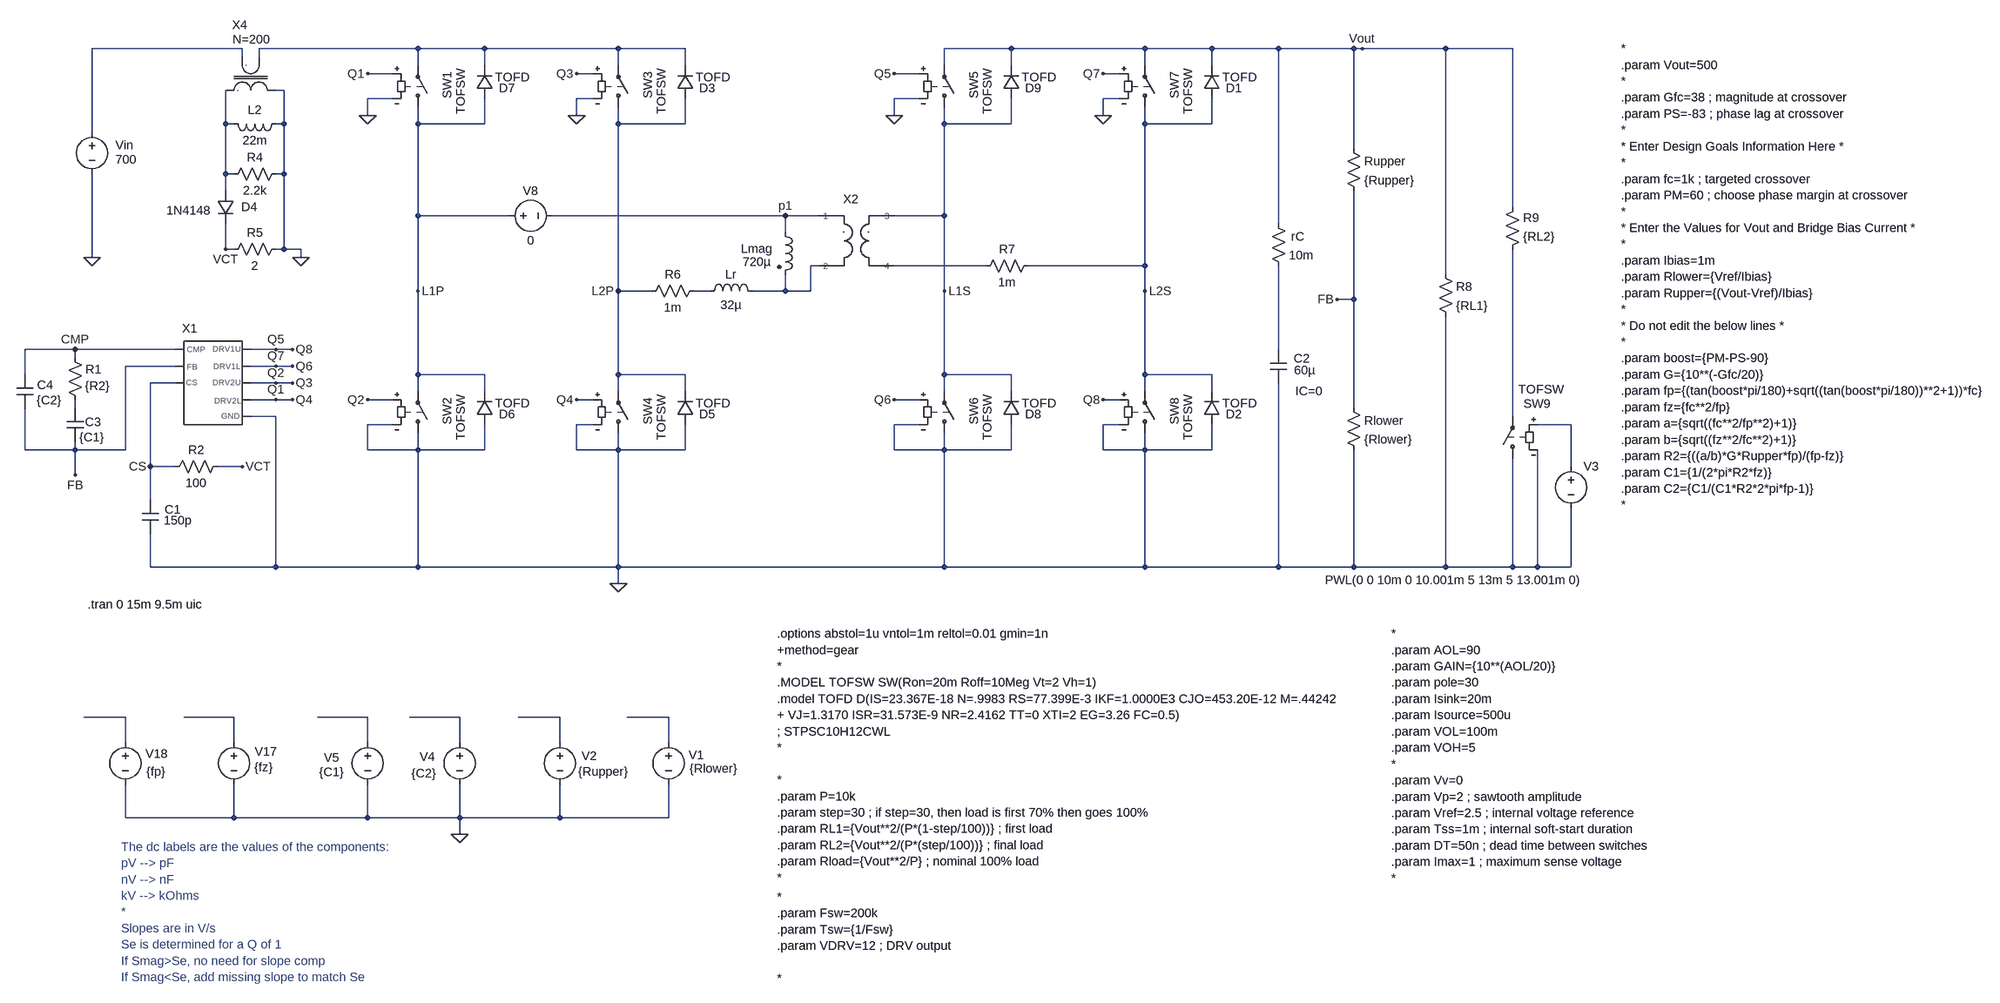
[diagram p0: schematic Dual Active Bridge VM - nonisolated - cbc - load step.asc]
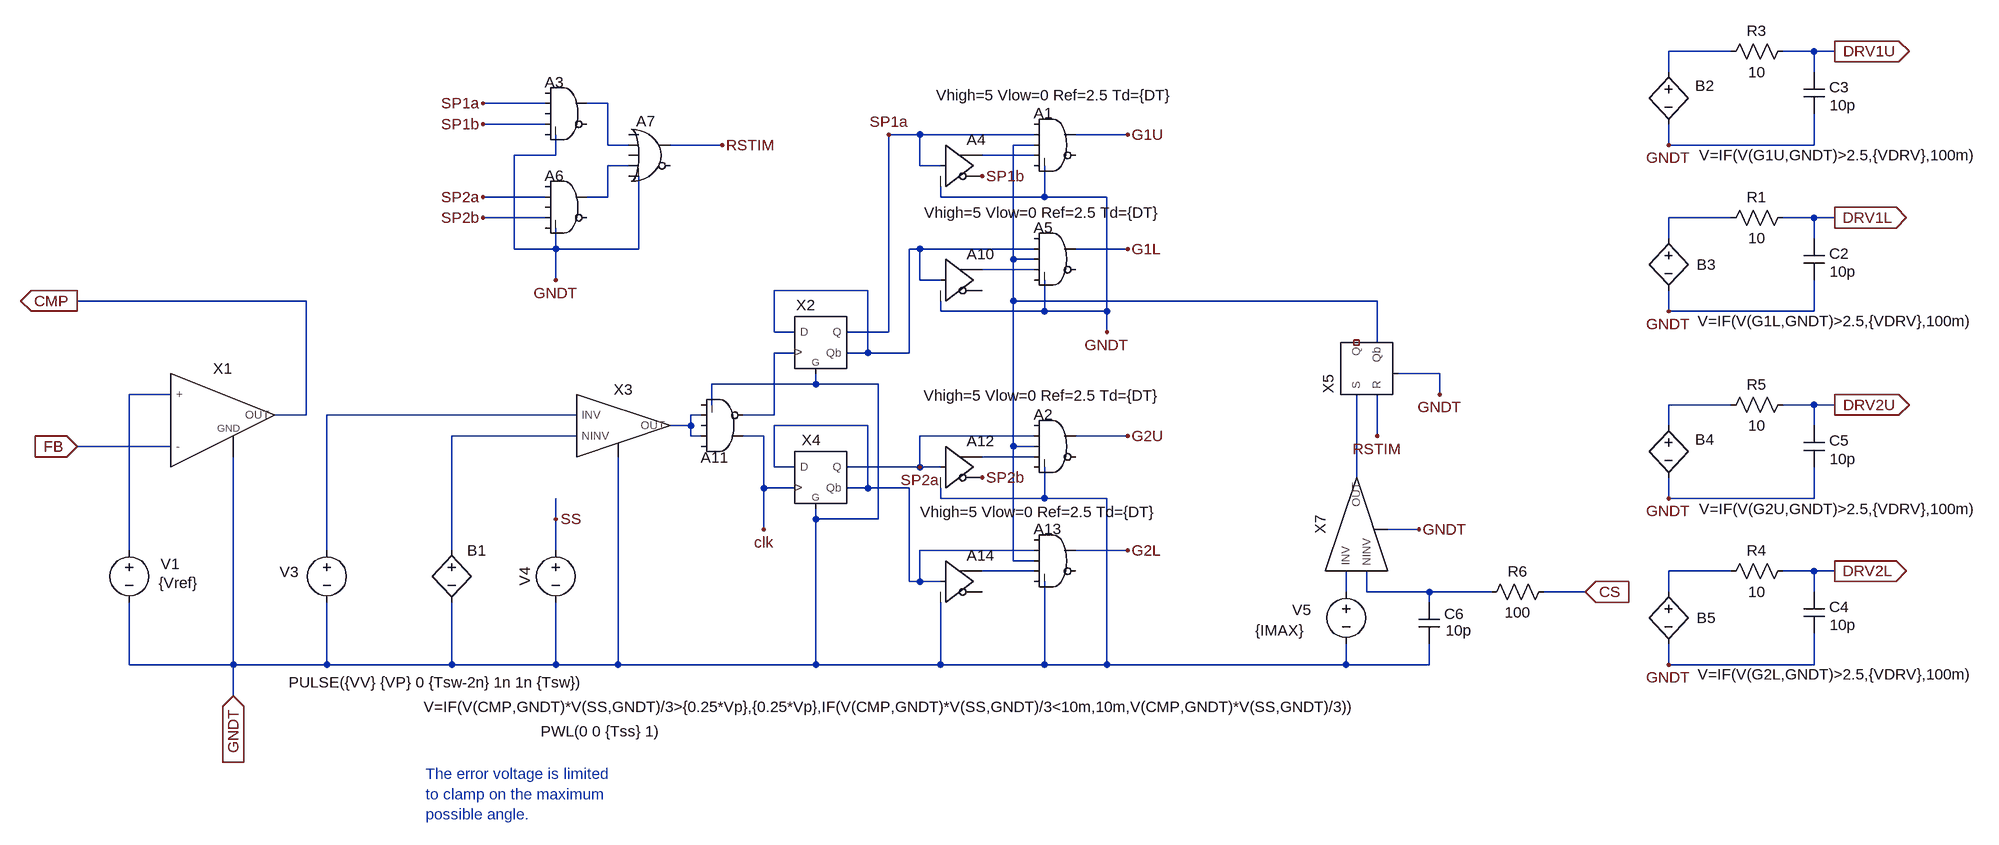
[diagram p1: sub-circuit generic_dab_vm_pwm.asc]
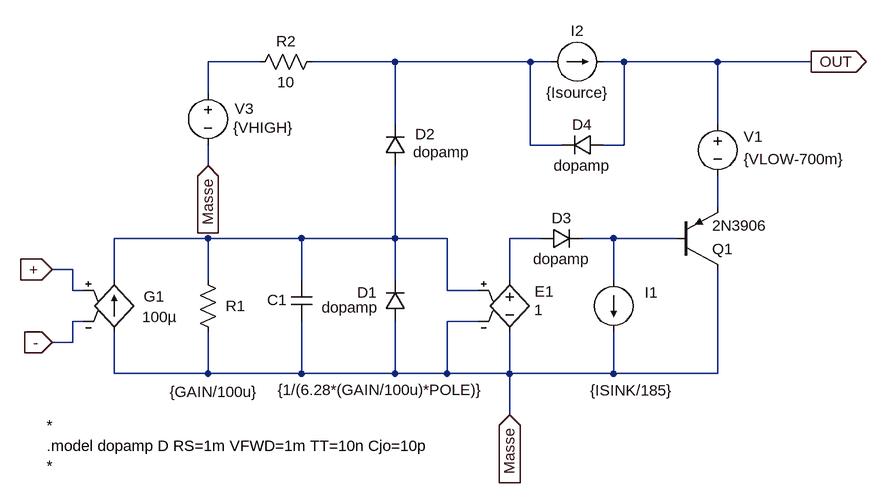
[diagram p2: sub-circuit op_amp_fan_out.asc]
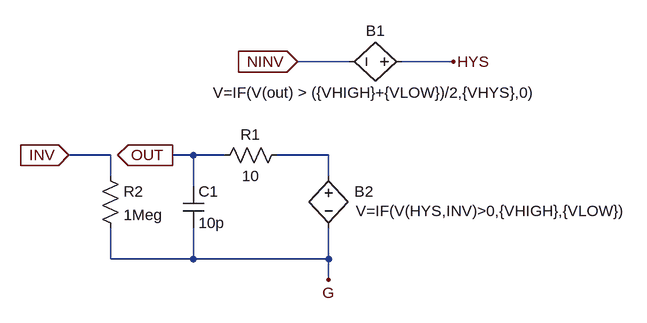
[diagram p3: sub-circuit comptof_g.asc]
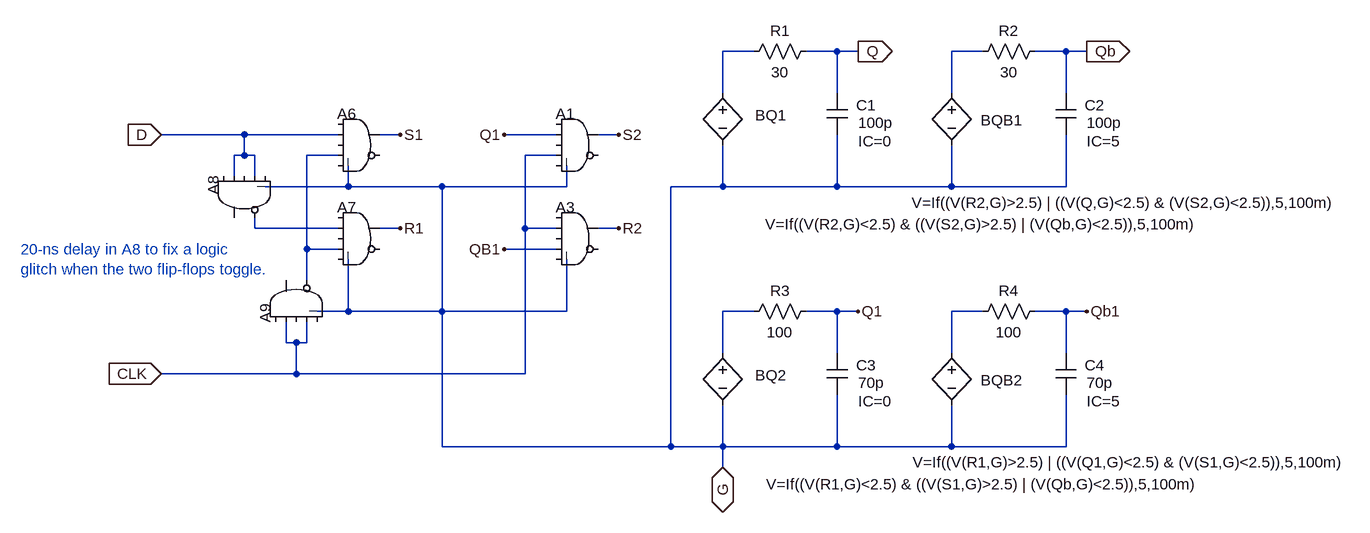
[diagram p4: sub-circuit d_flipflop_g.asc]
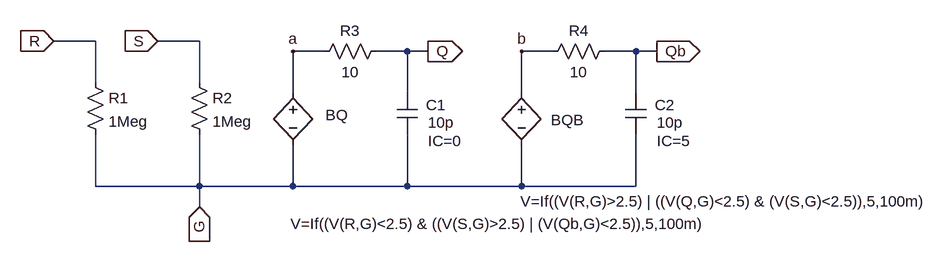
[diagram p5: sub-circuit sr_latch_g.asc]
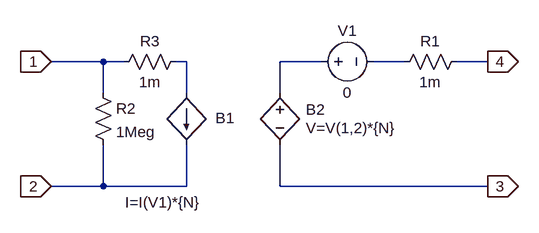
[diagram p6: sub-circuit ct_xfmr.asc]
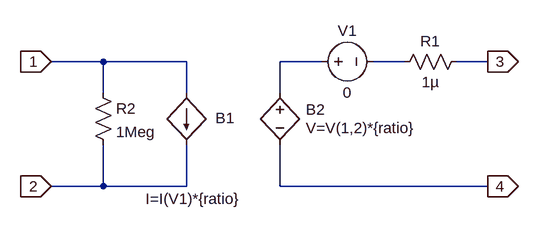
[diagram p7: sub-circuit xfmr.asc]
Dual Active Bridge VM - nonisolated - cbc - load step.asc, the LTspice schematic file:
Version 4.1
SHEET 1 4528 1992
WIRE 64 -384 -224 -384
WIRE 400 -384 96 -384
WIRE 528 -384 400 -384
WIRE 784 -384 528 -384
WIRE 912 -384 784 -384
WIRE 1536 -384 1408 -384
WIRE 1792 -384 1536 -384
WIRE 1920 -384 1792 -384
WIRE 2048 -384 1920 -384
WIRE 2192 -384 2048 -384
WIRE 2208 -384 2192 -384
WIRE 2368 -384 2208 -384
WIRE 2496 -384 2368 -384
WIRE 64 -368 64 -384
WIRE 96 -368 96 -384
WIRE 400 -352 400 -384
WIRE 528 -352 528 -384
WIRE 784 -352 784 -384
WIRE 912 -352 912 -384
WIRE 1408 -352 1408 -384
WIRE 1536 -352 1536 -384
WIRE 1792 -352 1792 -384
WIRE 1920 -352 1920 -384
WIRE 352 -336 304 -336
WIRE 736 -336 704 -336
WIRE 1360 -336 1312 -336
WIRE 1744 -336 1712 -336
WIRE 144 -304 128 -304
WIRE 352 -288 304 -288
WIRE 736 -288 704 -288
WIRE 1360 -288 1312 -288
WIRE 1744 -288 1712 -288
WIRE 304 -256 304 -288
WIRE 704 -256 704 -288
WIRE 1312 -256 1312 -288
WIRE 1712 -256 1712 -288
WIRE 32 -240 32 -304
WIRE 48 -240 32 -240
WIRE 144 -240 144 -304
WIRE 144 -240 128 -240
WIRE 400 -240 400 -272
WIRE 528 -240 528 -288
WIRE 528 -240 400 -240
WIRE 784 -240 784 -272
WIRE 912 -240 912 -288
WIRE 912 -240 784 -240
WIRE 1408 -240 1408 -272
WIRE 1536 -240 1536 -288
WIRE 1536 -240 1408 -240
WIRE 1792 -240 1792 -272
WIRE 1920 -240 1920 -288
WIRE 1920 -240 1792 -240
WIRE -224 -224 -224 -384
WIRE 2192 -192 2192 -384
WIRE 32 -144 32 -240
WIRE 48 -144 32 -144
WIRE 144 -144 144 -240
WIRE 144 -144 128 -144
WIRE 32 -112 32 -144
WIRE 2496 -80 2496 -384
WIRE 400 -64 400 -240
WIRE 576 -64 400 -64
WIRE 1104 -64 656 -64
WIRE 1168 -64 1104 -64
WIRE 1408 -64 1408 -240
WIRE 1408 -64 1312 -64
WIRE 2048 -48 2048 -384
WIRE 1104 -32 1104 -64
WIRE 32 0 32 -48
WIRE 48 0 32 0
WIRE 144 0 144 -144
WIRE 144 0 128 0
WIRE 176 0 144 0
WIRE -224 16 -224 -144
WIRE 176 16 176 0
WIRE 1168 32 1152 32
WIRE 1488 32 1312 32
WIRE 1792 32 1792 -240
WIRE 1792 32 1568 32
WIRE 2368 48 2368 -384
WIRE 400 80 400 -64
WIRE 784 80 784 -240
WIRE 848 80 784 80
WIRE 960 80 928 80
WIRE 1104 80 1104 48
WIRE 1104 80 1040 80
WIRE 1152 80 1152 32
WIRE 1152 80 1104 80
WIRE 1408 80 1408 -64
WIRE 1792 80 1792 32
WIRE 2192 96 2192 -112
WIRE 2192 96 2160 96
WIRE -256 192 -352 192
WIRE -64 192 -256 192
WIRE 128 192 80 192
WIRE 160 192 128 192
WIRE 2048 192 2048 32
WIRE -256 208 -256 192
WIRE -64 224 -160 224
WIRE 128 224 80 224
WIRE 160 224 128 224
WIRE -352 240 -352 192
WIRE 400 240 400 80
WIRE 528 240 400 240
WIRE 784 240 784 80
WIRE 912 240 784 240
WIRE 1408 240 1408 80
WIRE 1536 240 1408 240
WIRE 1792 240 1792 80
WIRE 1920 240 1792 240
WIRE -64 256 -112 256
WIRE 128 256 80 256
WIRE 160 256 128 256
WIRE 400 272 400 240
WIRE 528 272 528 240
WIRE 784 272 784 240
WIRE 912 272 912 240
WIRE 1408 272 1408 240
WIRE 1536 272 1536 240
WIRE 1792 272 1792 240
WIRE 1920 272 1920 240
WIRE 128 288 80 288
WIRE 160 288 128 288
WIRE 352 288 304 288
WIRE 736 288 704 288
WIRE 1360 288 1312 288
WIRE 1744 288 1712 288
WIRE -256 304 -256 288
WIRE 2192 304 2192 96
WIRE 128 320 80 320
WIRE 2496 320 2496 0
WIRE 352 336 304 336
WIRE 736 336 704 336
WIRE 1360 336 1312 336
WIRE 1744 336 1712 336
WIRE 2608 336 2544 336
WIRE -352 384 -352 304
WIRE -256 384 -256 368
WIRE -256 384 -352 384
WIRE -160 384 -160 224
WIRE -160 384 -256 384
WIRE 304 384 304 336
WIRE 400 384 400 352
WIRE 400 384 304 384
WIRE 528 384 528 336
WIRE 528 384 400 384
WIRE 704 384 704 336
WIRE 784 384 784 352
WIRE 784 384 704 384
WIRE 912 384 912 336
WIRE 912 384 784 384
WIRE 1312 384 1312 336
WIRE 1408 384 1408 352
WIRE 1408 384 1312 384
WIRE 1536 384 1536 336
WIRE 1536 384 1408 384
WIRE 1712 384 1712 336
WIRE 1792 384 1792 352
WIRE 1792 384 1712 384
WIRE 1920 384 1920 336
WIRE 1920 384 1792 384
WIRE -112 416 -112 256
WIRE -64 416 -112 416
WIRE 64 416 16 416
WIRE 2608 416 2608 336
WIRE -256 432 -256 384
WIRE -112 480 -112 416
WIRE -112 608 -112 544
WIRE 128 608 128 320
WIRE 128 608 -112 608
WIRE 400 608 400 384
WIRE 400 608 128 608
WIRE 784 608 784 384
WIRE 784 608 400 608
WIRE 1408 608 1408 384
WIRE 1408 608 784 608
WIRE 1792 608 1792 384
WIRE 1792 608 1408 608
WIRE 2048 608 2048 256
WIRE 2048 608 1792 608
WIRE 2192 608 2192 384
WIRE 2192 608 2048 608
WIRE 2368 608 2368 128
WIRE 2368 608 2192 608
WIRE 2496 608 2496 400
WIRE 2496 608 2368 608
WIRE 2544 608 2544 384
WIRE 2544 608 2496 608
WIRE 2608 608 2608 496
WIRE 2608 608 2544 608
WIRE 784 640 784 608
WIRE -160 896 -240 896
WIRE 48 896 -48 896
WIRE 304 896 208 896
WIRE 480 896 384 896
WIRE 672 896 592 896
WIRE 880 896 800 896
WIRE -160 944 -160 896
WIRE 48 944 48 896
WIRE 304 944 304 896
WIRE 480 944 480 896
WIRE 672 944 672 896
WIRE 880 944 880 896
WIRE -160 1088 -160 1024
WIRE 48 1088 48 1024
WIRE 48 1088 -160 1088
WIRE 304 1088 304 1024
WIRE 304 1088 48 1088
WIRE 480 1088 480 1024
WIRE 480 1088 304 1088
WIRE 672 1088 672 1024
WIRE 672 1088 480 1088
WIRE 880 1088 880 1024
WIRE 880 1088 672 1088
WIRE 480 1120 480 1088
FLAG -224 16 0
FLAG 2208 -384 Vout
FLAG 784 640 0
FLAG 480 1120 0
FLAG 304 -256 0
FLAG 704 -256 0
FLAG 304 -336 Q1
FLAG 704 288 Q4
FLAG 304 288 Q2
FLAG 704 -336 Q3
FLAG 1104 -64 p1
FLAG 2160 96 FB
FLAG -256 432 FB
FLAG -256 192 CMP
FLAG 400 80 L1P
FLAG 784 80 L2P
FLAG -112 416 CS
FLAG 32 0 VCT
FLAG 176 16 0
FLAG 1312 -256 0
FLAG 1712 -256 0
FLAG 1312 -336 Q5
FLAG 1712 288 Q8
FLAG 1312 288 Q6
FLAG 1712 -336 Q7
FLAG 1408 80 L1S
FLAG 1792 80 L2S
FLAG 160 192 Q8
FLAG 128 192 Q5
FLAG 160 224 Q6
FLAG 128 224 Q7
FLAG 160 256 Q3
FLAG 128 256 Q2
FLAG 160 288 Q4
FLAG 128 288 Q1
FLAG 64 416 VCT
DATAFLAG 224 896 ""
DATAFLAG 416 896 ""
DATAFLAG 608 896 ""
DATAFLAG 832 896 ""
DATAFLAG -32 896 ""
DATAFLAG -192 896 ""
SYMBOL ind2 1088 -48 R0
WINDOW 0 -69 47 Left 2
WINDOW 3 -66 72 Left 2
SYMATTR InstName Lmag
SYMATTR Value 720µ
SYMATTR Type ind
SYMBOL res 2032 -64 R0
WINDOW 0 40 40 Left 2
SYMATTR InstName rC
SYMATTR Value 10m
SYMBOL cap 2032 192 R0
WINDOW 0 45 17 Left 2
WINDOW 3 46 40 Left 2
WINDOW 123 48 80 Left 2
SYMATTR InstName C2
SYMATTR Value 60µ
SYMATTR Value2 IC=0
SYMBOL voltage -224 -240 R0
WINDOW 0 45 41 Left 2
WINDOW 3 45 68 Left 2
SYMATTR InstName Vin
SYMATTR Value 700
SYMBOL cap -128 480 R0
WINDOW 0 43 18 Left 2
WINDOW 3 42 39 Left 2
SYMATTR InstName C1
SYMATTR Value 150p
SYMBOL voltage 880 928 R0
WINDOW 0 39 40 Left 2
WINDOW 3 40 66 Left 2
WINDOW 123 0 0 Left 0
WINDOW 39 0 0 Left 0
SYMATTR InstName V1
SYMATTR Value {Rlower}
SYMBOL voltage 672 928 R0
WINDOW 0 42 42 Left 2
WINDOW 3 35 72 Left 2
WINDOW 123 0 0 Left 0
WINDOW 39 0 0 Left 0
SYMATTR InstName V2
SYMATTR Value {Rupper}
SYMBOL voltage 480 928 R0
WINDOW 0 -76 44 Left 2
WINDOW 3 -92 75 Left 2
SYMATTR InstName V4
SYMATTR Value {C2}
SYMBOL voltage 304 928 R0
WINDOW 0 -84 45 Left 2
WINDOW 3 -93 73 Left 2
WINDOW 123 0 0 Left 0
WINDOW 39 0 0 Left 0
SYMATTR InstName V5
SYMATTR Value {C1}
SYMBOL voltage 48 928 R0
WINDOW 0 40 34 Left 2
WINDOW 3 39 64 Left 2
WINDOW 123 0 0 Left 0
WINDOW 39 0 0 Left 0
SYMATTR InstName V17
SYMATTR Value {fz}
SYMBOL voltage -160 928 R0
WINDOW 0 39 38 Left 2
WINDOW 3 40 72 Left 2
SYMATTR InstName V18
SYMATTR Value {fp}
SYMBOL res 2176 288 R0
SYMATTR InstName Rlower
SYMATTR Value {Rlower}
SYMBOL res 2176 -208 R0
SYMATTR InstName Rupper
SYMATTR Value {Rupper}
SYMBOL sw 784 -256 M180
WINDOW 3 83 89 VLeft 2
WINDOW 0 57 84 VLeft 2
SYMATTR Value TOFSW
SYMATTR InstName SW3
SYMBOL diode 896 -288 M180
WINDOW 0 43 20 Left 2
WINDOW 3 36 41 Left 2
SYMATTR InstName D3
SYMATTR Value TOFD
SYMBOL sw 784 368 M180
WINDOW 3 83 89 VLeft 2
WINDOW 0 57 84 VLeft 2
SYMATTR Value TOFSW
SYMATTR InstName SW4
SYMBOL diode 896 336 M180
WINDOW 0 43 20 Left 2
WINDOW 3 36 41 Left 2
SYMATTR InstName D5
SYMATTR Value TOFD
SYMBOL sw 400 368 M180
WINDOW 3 83 89 VLeft 2
WINDOW 0 57 84 VLeft 2
SYMATTR Value TOFSW
SYMATTR InstName SW2
SYMBOL diode 512 336 M180
WINDOW 0 43 20 Left 2
WINDOW 3 36 41 Left 2
SYMATTR InstName D6
SYMATTR Value TOFD
SYMBOL sw 400 -256 M180
WINDOW 3 83 89 VLeft 2
WINDOW 0 57 84 VLeft 2
SYMATTR Value TOFSW
SYMATTR InstName SW1
SYMBOL diode 512 -288 M180
WINDOW 0 43 20 Left 2
WINDOW 3 36 41 Left 2
SYMATTR InstName D7
SYMATTR Value TOFD
SYMBOL voltage 560 -64 M90
WINDOW 0 -32 56 VBottom 2
WINDOW 3 32 56 VTop 2
SYMATTR InstName V8
SYMATTR Value 0
SYMBOL ind 944 96 R270
WINDOW 0 32 56 VTop 2
WINDOW 3 5 56 VBottom 2
SYMATTR InstName Lr
SYMATTR Value 32µ
SYMBOL cap -272 304 R0
WINDOW 0 35 27 Left 2
SYMATTR InstName C3
SYMATTR Value {C1}
SYMBOL res -272 192 R0
WINDOW 0 36 38 Left 2
WINDOW 3 35 70 Left 2
SYMATTR InstName R1
SYMATTR Value {R2}
SYMBOL cap -368 240 R0
WINDOW 0 39 20 Left 2
WINDOW 3 38 49 Left 2
SYMATTR InstName C4
SYMATTR Value {C2}
SYMBOL res 32 400 R90
WINDOW 0 0 56 VBottom 2
WINDOW 3 32 56 VTop 2
SYMATTR InstName R2
SYMATTR Value 100
SYMBOL ind 144 -256 R90
WINDOW 0 5 56 VBottom 2
WINDOW 3 32 56 VTop 2
SYMATTR InstName L2
SYMATTR Value 22m
SYMBOL res 144 -160 R90
WINDOW 0 0 56 VBottom 2
WINDOW 3 32 56 VTop 2
SYMATTR InstName R4
SYMATTR Value 2.2k
SYMBOL diode 16 -112 R0
WINDOW 0 46 31 Left 2
WINDOW 3 -97 38 Left 2
SYMATTR InstName D4
SYMATTR Value 1N4148
SYMBOL res 144 -16 R90
WINDOW 0 0 56 VBottom 2
WINDOW 3 32 56 VTop 2
SYMATTR InstName R5
SYMATTR Value 2
SYMBOL res 944 64 R90
WINDOW 0 0 56 VBottom 2
WINDOW 3 32 56 VTop 2
SYMATTR InstName R6
SYMATTR Value 1m
SYMBOL sw 1792 -256 M180
WINDOW 3 83 89 VLeft 2
WINDOW 0 57 84 VLeft 2
SYMATTR Value TOFSW
SYMATTR InstName SW7
SYMBOL diode 1904 -288 M180
WINDOW 0 43 20 Left 2
WINDOW 3 36 41 Left 2
SYMATTR InstName D1
SYMATTR Value TOFD
SYMBOL sw 1792 368 M180
WINDOW 3 83 89 VLeft 2
WINDOW 0 57 84 VLeft 2
SYMATTR Value TOFSW
SYMATTR InstName SW8
SYMBOL diode 1904 336 M180
WINDOW 0 43 20 Left 2
WINDOW 3 36 41 Left 2
SYMATTR InstName D2
SYMATTR Value TOFD
SYMBOL sw 1408 368 M180
WINDOW 3 83 89 VLeft 2
WINDOW 0 57 84 VLeft 2
SYMATTR Value TOFSW
SYMATTR InstName SW6
SYMBOL diode 1520 336 M180
WINDOW 0 43 20 Left 2
WINDOW 3 36 41 Left 2
SYMATTR InstName D8
SYMATTR Value TOFD
SYMBOL sw 1408 -256 M180
WINDOW 3 83 89 VLeft 2
WINDOW 0 57 84 VLeft 2
SYMATTR Value TOFSW
SYMATTR InstName SW5
SYMBOL diode 1520 -288 M180
WINDOW 0 43 20 Left 2
WINDOW 3 36 41 Left 2
SYMATTR InstName D9
SYMATTR Value TOFD
SYMBOL res 1584 16 R90
WINDOW 0 0 56 VBottom 2
WINDOW 3 32 56 VTop 2
SYMATTR InstName R7
SYMATTR Value 1m
SYMBOL res 2352 32 R0
SYMATTR InstName R8
SYMATTR Value {RL1}
SYMBOL res 2480 16 M180
WINDOW 0 36 76 Left 2
WINDOW 3 36 40 Left 2
SYMATTR InstName R9
SYMATTR Value {RL2}
SYMBOL sw 2496 416 R180
WINDOW 3 -98 148 Left 2
WINDOW 0 -73 120 Left 2
SYMATTR Value TOFSW
SYMATTR InstName SW9
SYMBOL voltage 2608 400 R0
WINDOW 3 -471 233 Left 2
WINDOW 123 0 0 Left 0
WINDOW 39 0 0 Left 0
SYMATTR Value PWL(0 0 10m 0 10.001m 5 13m 5 13.001m 0)
SYMATTR InstName V3
SYMBOL TOF\\Subcircuits\\Generic_DAB_VM_PWM 0 192 R0
WINDOW 0 -37 -25 Bottom 2
SYMATTR InstName X1
SYMATTR SpiceLine gain={gain} pole={pole} Isink={Isink} Isource={Isource} Vlow={VOL} Vhigh={VOH} DT={DT}
SYMBOL TOF\\Subcircuits\\CT_xfmr 64 -320 M90
WINDOW 0 -125 -5 VTop 2
WINDOW 39 -97 17 VTop 2
SYMATTR InstName X4
SYMATTR SpiceLine N=200
SYMBOL TOF\\Subcircuits\\XFMR 1200 -48 R0
WINDOW 0 29 -32 Bottom 2
SYMATTR InstName X2
SYMATTR SpiceLine Ratio=650m
TEXT -232 680 Left 2 !.tran 0 15m 9.5m uic
TEXT 1088 1240 Left 2 !*\n.param Fsw=200k\n.param Tsw={1/Fsw}\n.param VDRV=12 ; DRV output\n \n*
TEXT 2264 736 Left 2 !* \n.param AOL=90\n.param GAIN={10**(AOL/20)}\n.param pole=30\n.param Isink=20m\n.param Isource=500u\n.param VOL=100m\n.param VOH=5\n*\n.param Vv=0\n.param Vp=2 ; sawtooth amplitude\n.param Vref=2.5 ; internal voltage reference\n.param Tss=1m ; internal soft-start duration\n.param DT=50n ; dead time between switches\n.param Imax=1 ; maximum sense voltage\n*
TEXT -168 1144 Left 2 ;The dc labels are the values of the components:\npV --> pF\nnV --> nF\nkV --> kOhms\n*\nSlopes are in V/s\nSe is determined for a Q of 1\nIf Smag>Se, no need for slope comp\nIf Smag<Se, add missing slope to match Se
TEXT 2704 -384 Left 2 !*\n.param Vout=500\n*\n.param Gfc=38 ; magnitude at crossover\n.param PS=-83 ; phase lag at crossover\n*\n* Enter Design Goals Information Here *\n*\n.param fc=1k ; targeted crossover\n.param PM=60 ; choose phase margin at crossover\n*\n* Enter the Values for Vout and Bridge Bias Current *\n*\n.param Ibias=1m\n.param Rlower={Vref/Ibias}\n.param Rupper={(Vout-Vref)/Ibias}\n*\n* Do not edit the below lines *\n*\n.param boost={PM-PS-90}\n.param G={10**(-Gfc/20)}\n.param fp={(tan(boost*pi/180)+sqrt((tan(boost*pi/180))**2+1))*fc}\n.param fz={fc**2/fp}\n.param a={sqrt((fc**2/fp**2)+1)}\n.param b={sqrt((fz**2/fc**2)+1)}\n.param R2={((a/b)*G*Rupper*fp)/(fp-fz)}\n.param C1={1/(2*pi*R2*fz)}\n.param C2={C1/(C1*R2*2*pi*fp-1)}\n*
TEXT 1088 736 Left 2 !.options abstol=1u vntol=1m reltol=0.01 gmin=1n\n+method=gear\n*\n.MODEL TOFSW SW(Ron=20m Roff=10Meg Vt=2 Vh=1)\n.model TOFD D(IS=23.367E-18 N=.9983 RS=77.399E-3 IKF=1.0000E3 CJO=453.20E-12 M=.44242\n+ VJ=1.3170 ISR=31.573E-9 NR=2.4162 TT=0 XTI=2 EG=3.26 FC=0.5)\n; STPSC10H12CWL\n*
TEXT 1088 1016 Left 2 !*\n.param P=10k\n.param step=30 ; if step=30, then load is first 70% then goes 100%\n.param RL1={Vout**2/(P*(1-step/100))} ; first load\n.param RL2={Vout**2/(P*(step/100))} ; final load\n.param Rload={Vout**2/P} ; nominal 100% load\n*

generic_dab_vm_pwm.asc, the sub-circuit schematic file:
Version 4.1
SHEET 1 1568 1692
WIRE 1072 -832 976 -832
WIRE 1200 -832 1152 -832
WIRE 1232 -832 1200 -832
WIRE 976 -800 976 -832
WIRE 1200 -800 1200 -832
WIRE -752 -752 -848 -752
WIRE -656 -752 -688 -752
WIRE -752 -720 -848 -720
WIRE -176 -704 -224 -704
WIRE 0 -704 -176 -704
WIRE 144 -704 64 -704
WIRE -656 -688 -656 -752
WIRE -624 -688 -656 -688
WIRE -480 -688 -560 -688
WIRE 0 -688 -32 -688
WIRE 976 -688 976 -720
WIRE 1200 -688 1200 -736
WIRE 1200 -688 976 -688
WIRE -736 -672 -736 -704
WIRE -736 -672 -800 -672
WIRE 0 -672 -80 -672
WIRE -624 -656 -656 -656
WIRE -176 -656 -176 -704
WIRE -144 -656 -176 -656
WIRE -752 -608 -848 -608
WIRE -656 -608 -656 -656
WIRE -656 -608 -688 -608
WIRE -144 -608 -144 -624
WIRE 16 -608 16 -656
WIRE 16 -608 -144 -608
WIRE 112 -608 16 -608
WIRE -752 -576 -848 -576
WIRE 1072 -576 976 -576
WIRE 1200 -576 1152 -576
WIRE 1232 -576 1200 -576
WIRE 976 -544 976 -576
WIRE 1200 -544 1200 -576
WIRE -800 -528 -800 -672
WIRE -736 -528 -736 -560
WIRE -736 -528 -800 -528
WIRE -608 -528 -608 -640
WIRE -608 -528 -736 -528
WIRE -176 -528 -192 -528
WIRE 0 -528 -176 -528
WIRE 144 -528 64 -528
WIRE -32 -512 -32 -688
WIRE 0 -512 -32 -512
WIRE 0 -496 -80 -496
WIRE -736 -480 -736 -528
WIRE -176 -480 -176 -528
WIRE -144 -480 -176 -480
WIRE -256 -464 -400 -464
WIRE -1120 -448 -1472 -448
WIRE -32 -448 -32 -512
WIRE 528 -448 -32 -448
WIRE -144 -432 -144 -448
WIRE 16 -432 16 -480
WIRE 16 -432 -144 -432
WIRE 112 -432 112 -608
WIRE 112 -432 16 -432
WIRE 976 -432 976 -464
WIRE 1200 -432 1200 -480
WIRE 1200 -432 976 -432
WIRE -400 -400 -400 -464
WIRE -368 -400 -400 -400
WIRE -224 -400 -224 -704
WIRE -224 -400 -288 -400
WIRE 112 -400 112 -432
WIRE 528 -384 528 -448
WIRE -368 -368 -400 -368
WIRE -256 -368 -256 -464
WIRE -256 -368 -288 -368
WIRE -192 -368 -192 -528
WIRE -192 -368 -256 -368
WIRE 624 -336 560 -336
WIRE -336 -320 -336 -336
WIRE -336 -320 -496 -320
WIRE -240 -320 -336 -320
WIRE -1328 -304 -1392 -304
WIRE 624 -304 624 -336
WIRE -496 -288 -496 -320
WIRE 1072 -288 976 -288
WIRE 1200 -288 1152 -288
WIRE 1232 -288 1200 -288
WIRE -1120 -272 -1120 -448
WIRE -1120 -272 -1168 -272
WIRE -704 -272 -1088 -272
WIRE -512 -272 -528 -272
WIRE -400 -272 -400 -368
WIRE -400 -272 -448 -272
WIRE -528 -256 -528 -272
WIRE -528 -256 -560 -256
WIRE -256 -256 -400 -256
WIRE 976 -256 976 -288
WIRE 1200 -256 1200 -288
WIRE -704 -240 -896 -240
WIRE -528 -240 -528 -256
WIRE -512 -240 -528 -240
WIRE -416 -240 -448 -240
WIRE 0 -240 -176 -240
WIRE 144 -240 64 -240
WIRE 528 -240 528 -304
WIRE -1328 -224 -1472 -224
WIRE -32 -224 -32 -448
WIRE 0 -224 -32 -224
WIRE 0 -208 -80 -208
WIRE -400 -192 -400 -256
WIRE -368 -192 -400 -192
WIRE -176 -192 -176 -240
WIRE -176 -192 -288 -192
WIRE -144 -192 -176 -192
WIRE 496 -176 496 -304
WIRE -416 -160 -416 -240
WIRE -368 -160 -416 -160
WIRE -256 -160 -256 -256
WIRE -256 -160 -288 -160
WIRE -192 -160 -256 -160
WIRE -144 -144 -144 -160
WIRE 16 -144 16 -192
WIRE 16 -144 -144 -144
WIRE 112 -144 16 -144
WIRE 976 -144 976 -176
WIRE 1200 -144 1200 -192
WIRE 1200 -144 976 -144
WIRE -736 -112 -736 -144
WIRE -336 -112 -336 -128
WIRE -240 -112 -240 -320
WIRE -240 -112 -336 -112
WIRE -416 -96 -416 -160
WIRE 592 -96 544 -96
WIRE -1392 -64 -1392 -304
WIRE -1088 -64 -1088 -272
WIRE -896 -64 -896 -240
WIRE -736 -64 -736 -112
WIRE 0 -64 -176 -64
WIRE 144 -64 64 -64
WIRE -32 -48 -32 -224
WIRE 0 -48 -32 -48
WIRE 0 -32 -80 -32
WIRE 1072 -32 976 -32
WIRE 1200 -32 1152 -32
WIRE 1232 -32 1200 -32
WIRE -192 -16 -192 -160
WIRE -176 -16 -176 -64
WIRE -176 -16 -192 -16
WIRE -144 -16 -176 -16
WIRE 480 0 480 -32
WIRE 512 0 512 -32
WIRE 608 0 512 0
WIRE 704 0 608 0
WIRE 848 0 784 0
WIRE 976 0 976 -32
WIRE 1200 0 1200 -32
WIRE 608 16 608 0
WIRE -1392 112 -1392 16
WIRE -1232 112 -1232 -208
WIRE -1232 112 -1392 112
WIRE -1088 112 -1088 16
WIRE -1088 112 -1232 112
WIRE -896 112 -896 16
WIRE -896 112 -1088 112
WIRE -736 112 -736 16
WIRE -736 112 -896 112
WIRE -640 112 -640 -208
WIRE -640 112 -736 112
WIRE -336 112 -336 -112
WIRE -336 112 -640 112
WIRE -144 112 -144 16
WIRE -144 112 -336 112
WIRE 16 112 16 -16
WIRE 16 112 -144 112
WIRE 112 112 112 -144
WIRE 112 112 16 112
WIRE 480 112 480 80
WIRE 480 112 112 112
WIRE 608 112 608 80
WIRE 608 112 480 112
WIRE 976 112 976 80
WIRE 1200 112 1200 64
WIRE 1200 112 976 112
WIRE -1232 160 -1232 112
FLAG -1472 -448 CMP
IOPIN -1472 -448 Out
FLAG -1472 -224 FB
IOPIN -1472 -224 In
FLAG -1232 160 GNDT
IOPIN -1232 160 In
FLAG -736 -112 SS
FLAG 976 -432 GNDT
FLAG 976 -688 GNDT
FLAG 1232 -576 DRV1L
IOPIN 1232 -576 Out
FLAG 1232 -832 DRV1U
IOPIN 1232 -832 Out
FLAG 976 112 GNDT
FLAG 976 -144 GNDT
FLAG 1232 -32 DRV2L
IOPIN 1232 -32 Out
FLAG 1232 -288 DRV2U
IOPIN 1232 -288 Out
FLAG 144 -704 G1U
FLAG 144 -528 G1L
FLAG 144 -240 G2U
FLAG 144 -64 G2L
FLAG 112 -400 GNDT
FLAG -416 -96 clk
FLAG -224 -704 SP1a
FLAG -80 -640 SP1b
FLAG -176 -192 SP2a
FLAG -80 -176 SP2b
FLAG 848 0 CS
IOPIN 848 0 In
FLAG 592 -96 GNDT
FLAG 624 -304 GNDT
FLAG 528 -240 RSTIM
FLAG -848 -752 SP1a
FLAG -848 -720 SP1b
FLAG -848 -608 SP2a
FLAG -848 -576 SP2b
FLAG -480 -688 RSTIM
FLAG -736 -480 GNDT
SYMBOL op_amp_fan_out -1248 -272 R0
SYMATTR InstName X1
SYMATTR SpiceLine gain={gain} pole={pole} Isink={Isink} Isource={Isource} Vlow={VOL} Vhigh={VOH}
SYMBOL voltage -1392 -80 R0
WINDOW 0 48 37 Left 2
WINDOW 3 45 66 Left 2
SYMATTR InstName V1
SYMATTR Value {Vref}
SYMBOL voltage -1088 -80 R0
WINDOW 0 -73 49 Left 2
WINDOW 3 -59 219 Left 2
WINDOW 123 0 0 Left 0
WINDOW 39 0 0 Left 0
SYMATTR InstName V3
SYMATTR Value PULSE({VV} {VP} 0 {Tsw-2n} 1n 1n {Tsw})
SYMBOL bv -896 -80 R0
WINDOW 3 -43 257 Left 2
SYMATTR Value V=IF(V(CMP,GNDT)*V(SS,GNDT)/3>{0.25*Vp},{0.25*Vp},IF(V(CMP,GNDT)*V(SS,GNDT)/3<10m,10m,V(CMP,GNDT)*V(SS,GNDT)/3))
SYMATTR InstName B1
SYMBOL voltage -736 -80 R0
WINDOW 0 -32 56 VBottom 2
WINDOW 3 69 279 Top 2
WINDOW 123 0 0 Left 0
WINDOW 39 0 0 Left 0
SYMATTR InstName V4
SYMATTR Value PWL(0 0 {Tss} 1)
SYMBOL bv 976 -816 R0
WINDOW 0 41 37 Left 2
WINDOW 3 47 144 Left 2
SYMATTR InstName B2
SYMATTR Value V=IF(V(G1U,GNDT)>2.5,{VDRV},100m)
SYMBOL bv 976 -560 R0
WINDOW 0 43 56 Left 2
WINDOW 3 45 143 Left 2
SYMATTR InstName B3
SYMATTR Value V=IF(V(G1L,GNDT)>2.5,{VDRV},100m)
SYMBOL res 1168 -592 R90
WINDOW 0 0 56 VBottom 2
WINDOW 3 32 56 VTop 2
SYMATTR InstName R1
SYMATTR Value 10
SYMBOL cap 1184 -544 R0
WINDOW 0 39 23 Left 2
WINDOW 3 40 51 Left 2
SYMATTR InstName C2
SYMATTR Value 10p
SYMBOL res 1168 -848 R90
WINDOW 0 0 56 VBottom 2
WINDOW 3 32 56 VTop 2
SYMATTR InstName R3
SYMATTR Value 10
SYMBOL cap 1184 -800 R0
WINDOW 0 39 23 Left 2
WINDOW 3 40 51 Left 2
SYMATTR InstName C3
SYMATTR Value 10p
SYMBOL Digital\\and 32 -752 R0
WINDOW 0 -33 15 Left 2
SYMATTR InstName A1
SYMATTR SpiceLine Vhigh=5 Vlow=0 Ref=2.5
SYMBOL Digital\\buf -144 -720 R0
WINDOW 39 -7 -45 Left 2
SYMATTR SpiceLine Vhigh=5 Vlow=0 Ref=2.5 Td={DT}
SYMATTR InstName A4
SYMBOL Digital\\and 32 -576 R0
WINDOW 0 -33 15 Left 2
SYMATTR InstName A5
SYMATTR SpiceLine Vhigh=5 Vlow=0 Ref=2.5
SYMBOL Digital\\buf -144 -544 R0
WINDOW 39 -25 -40 Left 2
SYMATTR SpiceLine Vhigh=5 Vlow=0 Ref=2.5 Td={DT}
SYMATTR InstName A10
SYMBOL Digital\\and -480 -192 M180
WINDOW 0 -33 15 Left 2
SYMATTR InstName A11
SYMATTR SpiceLine Vhigh=5 Vlow=0 Ref=2.5
SYMBOL Digital\\and 32 -288 R0
WINDOW 0 -33 15 Left 2
SYMATTR InstName A2
SYMATTR SpiceLine Vhigh=5 Vlow=0 Ref=2.5
SYMBOL Digital\\buf -144 -256 R0
WINDOW 39 -26 -46 Left 2
SYMATTR SpiceLine Vhigh=5 Vlow=0 Ref=2.5 Td={DT}
SYMATTR InstName A12
SYMBOL Digital\\and 32 -112 R0
WINDOW 0 -33 15 Left 2
SYMATTR InstName A13
SYMATTR SpiceLine Vhigh=5 Vlow=0 Ref=2.5
SYMBOL Digital\\buf -144 -80 R0
WINDOW 39 -31 -43 Left 2
SYMATTR SpiceLine Vhigh=5 Vlow=0 Ref=2.5 Td={DT}
SYMATTR InstName A14
SYMBOL bv 976 -272 R0
WINDOW 0 41 37 Left 2
WINDOW 3 47 144 Left 2
SYMATTR InstName B4
SYMATTR Value V=IF(V(G2U,GNDT)>2.5,{VDRV},100m)
SYMBOL bv 976 -16 R0
WINDOW 0 43 56 Left 2
WINDOW 3 45 143 Left 2
SYMATTR InstName B5
SYMATTR Value V=IF(V(G2L,GNDT)>2.5,{VDRV},100m)
SYMBOL res 1168 -48 R90
WINDOW 0 0 56 VBottom 2
WINDOW 3 32 56 VTop 2
SYMATTR InstName R4
SYMATTR Value 10
SYMBOL cap 1184 0 R0
WINDOW 0 39 23 Left 2
WINDOW 3 40 51 Left 2
SYMATTR InstName C4
SYMATTR Value 10p
SYMBOL res 1168 -304 R90
WINDOW 0 0 56 VBottom 2
WINDOW 3 32 56 VTop 2
SYMATTR InstName R5
SYMATTR Value 10
SYMBOL cap 1184 -256 R0
WINDOW 0 39 23 Left 2
WINDOW 3 40 51 Left 2
SYMATTR InstName C5
SYMATTR Value 10p
SYMBOL voltage 480 -16 R0
WINDOW 0 -83 44 Left 2
WINDOW 3 -140 75 Left 2
SYMATTR InstName V5
SYMATTR Value {IMAX}
SYMBOL res 800 -16 R90
WINDOW 0 0 56 VBottom 2
WINDOW 3 32 56 VTop 2
SYMATTR InstName R6
SYMATTR Value 100
SYMBOL cap 592 16 R0
WINDOW 0 39 18 Left 2
WINDOW 3 41 43 Left 2
SYMATTR InstName C6
SYMATTR Value 10p
SYMBOL Digital\\and -720 -800 R0
WINDOW 0 -33 15 Left 2
SYMATTR InstName A3
SYMATTR SpiceLine Vhigh=5 Vlow=0 Ref=2.5
SYMBOL Digital\\and -720 -656 R0
WINDOW 0 -33 15 Left 2
SYMATTR InstName A6
SYMATTR SpiceLine Vhigh=5 Vlow=0 Ref=2.5
SYMBOL Digital\\or -592 -736 R0
WINDOW 0 -20 11 Left 2
SYMATTR InstName A7
SYMATTR SpiceLine Vhigh=5 Vlow=0 Ref=2.5
SYMBOL TOF\\Subcircuits\\COMPTOF_G -640 -256 R0
SYMATTR InstName X3
SYMATTR SpiceLine VHIGH=5 VLOW=100m VHYS=10m
SYMBOL TOF\\Subcircuits\\D_FlipFlop_G -336 -384 R0
WINDOW 0 -15 -42 Bottom 2
SYMATTR InstName X2
SYMBOL TOF\\Subcircuits\\D_FlipFlop_G -336 -176 R0
WINDOW 0 -7 -42 Bottom 2
SYMATTR InstName X4
SYMBOL TOF\\Subcircuits\\SR_latch_G 512 -336 R270
WINDOW 0 -16 -44 Bottom 2
SYMATTR InstName X5
SYMBOL TOF\\Subcircuits\\COMPTOF_G 496 -96 R270
SYMATTR InstName X7
SYMATTR SpiceLine VHIGH=5 VLOW=100m VHYS=50m
TEXT -936 280 Left 2 ;The error voltage is limited\nto clamp on the maximum \npossible angle.

op_amp_fan_out.asc, the sub-circuit schematic file:
Version 4.1
SHEET 1 1504 680
WIRE 96 -224 16 -224
WIRE 304 -224 176 -224
WIRE 512 -224 304 -224
WIRE 544 -224 512 -224
WIRE 656 -224 624 -224
WIRE 800 -224 656 -224
WIRE 944 -224 800 -224
WIRE 16 -176 16 -224
WIRE 304 -128 304 -224
WIRE 800 -128 800 -224
WIRE 512 -96 512 -224
WIRE 560 -96 512 -96
WIRE 656 -96 656 -224
WIRE 656 -96 624 -96
WIRE 16 -64 16 -96
WIRE 800 0 800 -48
WIRE 16 48 -128 48
WIRE 160 48 16 48
WIRE 304 48 304 -64
WIRE 304 48 160 48
WIRE 384 48 304 48
WIRE 528 48 480 48
WIRE 640 48 592 48
WIRE 736 48 640 48
WIRE -192 96 -224 96
WIRE -128 112 -128 48
WIRE 16 112 16 48
WIRE 160 112 160 48
WIRE 304 112 304 48
WIRE 480 112 480 48
WIRE 640 112 640 48
WIRE -192 128 -192 96
WIRE -176 128 -192 128
WIRE 384 128 384 48
WIRE 432 128 384 128
WIRE -176 176 -192 176
WIRE 432 176 384 176
WIRE -192 208 -192 176
WIRE -192 208 -224 208
WIRE -128 256 -128 192
WIRE 16 256 16 192
WIRE 16 256 -128 256
WIRE 160 256 160 176
WIRE 160 256 16 256
WIRE 304 256 304 176
WIRE 304 256 160 256
WIRE 384 256 384 176
WIRE 384 256 304 256
WIRE 480 256 480 192
WIRE 480 256 384 256
WIRE 640 256 640 192
WIRE 640 256 480 256
WIRE 800 256 800 96
WIRE 800 256 640 256
WIRE 480 320 480 256
FLAG -224 96 +
IOPIN -224 96 In
FLAG -224 208 -
IOPIN -224 208 In
FLAG 944 -224 OUT
IOPIN 944 -224 Out
FLAG 480 320 Masse
IOPIN 480 320 In
FLAG 16 -64 Masse
IOPIN 16 -64 In
DATAFLAG 800 -16 ""
SYMBOL g -128 96 R0
WINDOW 0 45 41 Left 2
WINDOW 3 43 73 Left 2
SYMATTR InstName G1
SYMATTR Value 100µ
SYMBOL res 0 96 R0
WINDOW 0 43 56 Left 2
WINDOW 3 -43 188 Left 2
SYMATTR InstName R1
SYMATTR Value {GAIN/100u}
SYMBOL cap 144 112 R0
WINDOW 0 -37 31 Left 2
WINDOW 3 -21 169 Left 2
SYMATTR InstName C1
SYMATTR Value {1/(6.28*(GAIN/100u)*POLE)}
SYMBOL diode 320 176 R180
WINDOW 0 44 45 Left 2
WINDOW 3 41 22 Left 2
SYMATTR InstName D1
SYMATTR Value dopamp
SYMBOL e 480 96 R0
WINDOW 0 39 34 Left 2
WINDOW 3 38 62 Left 2
SYMATTR InstName E1
SYMATTR Value 1
SYMBOL diode 528 64 R270
WINDOW 0 32 32 VTop 2
WINDOW 3 0 32 VBottom 2
SYMATTR InstName D3
SYMATTR Value dopamp
SYMBOL current 640 112 R0
WINDOW 0 48 19 Left 2
WINDOW 3 -36 170 Left 2
SYMATTR InstName I1
SYMATTR Value {ISINK/185}
SYMBOL pnp 736 96 M180
SYMATTR InstName Q1
SYMATTR Value 2N3906
SYMBOL voltage 800 -144 R0
WINDOW 0 40 35 Left 2
WINDOW 3 40 70 Left 2
SYMATTR InstName V1
SYMATTR Value {VLOW-700m}
SYMBOL current 544 -224 R270
WINDOW 0 32 40 VTop 2
WINDOW 3 -32 40 VBottom 2
SYMATTR InstName I2
SYMATTR Value {Isource}
SYMBOL diode 624 -80 M270
WINDOW 0 32 32 VTop 2
WINDOW 3 0 32 VBottom 2
SYMATTR InstName D4
SYMATTR Value dopamp
SYMBOL voltage 16 -192 R0
WINDOW 0 41 40 Left 2
WINDOW 3 39 69 Left 2
SYMATTR InstName V3
SYMATTR Value {VHIGH}
SYMBOL diode 288 -64 M180
WINDOW 0 47 49 Left 2
WINDOW 3 44 21 Left 2
SYMATTR InstName D2
SYMATTR Value dopamp
SYMBOL res 192 -240 R90
WINDOW 0 0 56 VBottom 2
WINDOW 3 32 56 VTop 2
SYMATTR InstName R2
SYMATTR Value 10
TEXT -232 336 Left 2 !*\n.model dopamp D RS=1m VFWD=1m TT=10n Cjo=10p\n*

comptof_g.asc, the sub-circuit schematic file:
Version 4.1
SHEET 1 880 680
WIRE 64 192 -16 192
WIRE 224 192 144 192
WIRE -304 336 -368 336
WIRE -176 336 -208 336
WIRE -128 336 -176 336
WIRE 32 336 -48 336
WIRE -304 368 -304 336
WIRE 32 368 32 336
WIRE -176 384 -176 336
WIRE -304 496 -304 448
WIRE -176 496 -176 448
WIRE -176 496 -304 496
WIRE 32 496 32 448
WIRE 32 496 -176 496
WIRE 32 528 32 496
FLAG -16 192 NINV
IOPIN -16 192 In
FLAG 224 192 HYS
FLAG -208 336 OUT
IOPIN -208 336 Out
FLAG -368 336 INV
IOPIN -368 336 In
FLAG 32 528 G
SYMBOL bv 160 192 R90
WINDOW 0 -32 56 VBottom 2
WINDOW 3 32 56 VTop 2
SYMATTR InstName B1
SYMATTR Value V=IF(V(out) > ({VHIGH}+{VLOW})/2,{VHYS},0)
SYMBOL bv 32 352 R0
WINDOW 0 40 40 Left 2
WINDOW 3 42 70 Left 2
SYMATTR InstName B2
SYMATTR Value V=IF(V(HYS,INV)>0,{VHIGH},{VLOW})
SYMBOL res -32 320 R90
WINDOW 0 0 56 VBottom 2
WINDOW 3 32 56 VTop 2
SYMATTR InstName R1
SYMATTR Value 10
SYMBOL cap -192 384 R0
SYMATTR InstName C1
SYMATTR Value 10p
SYMBOL res -320 352 R0
SYMATTR InstName R2
SYMATTR Value 1Meg

d_flipflop_g.asc, the sub-circuit schematic file:
Version 4.1
SHEET 1 1820 1368
WIRE 768 448 720 448
WIRE 896 448 848 448
WIRE 928 448 896 448
WIRE 1120 448 1072 448
WIRE 1248 448 1200 448
WIRE 1280 448 1248 448
WIRE 720 512 720 448
WIRE 896 512 896 448
WIRE 1072 512 1072 448
WIRE 1248 512 1248 448
WIRE -16 576 -144 576
WIRE 128 576 -16 576
WIRE 224 576 192 576
WIRE 464 576 384 576
WIRE 560 576 528 576
WIRE -16 608 -16 576
WIRE -16 608 -32 608
WIRE 0 608 -16 608
WIRE 128 608 80 608
WIRE 464 608 416 608
WIRE -32 640 -32 608
WIRE 0 640 0 608
WIRE 144 656 144 624
WIRE 144 656 16 656
WIRE 288 656 144 656
WIRE 480 656 480 624
WIRE 480 656 288 656
WIRE 720 656 720 592
WIRE 720 656 640 656
WIRE 896 656 896 576
WIRE 896 656 720 656
WIRE 1072 656 1072 592
WIRE 1072 656 896 656
WIRE 1248 656 1248 576
WIRE 1248 656 1072 656
WIRE 0 720 0 704
WIRE 128 720 0 720
WIRE 224 720 192 720
WIRE 416 720 416 608
WIRE 464 720 416 720
WIRE 560 720 528 720
WIRE 80 752 80 608
WIRE 128 752 80 752
WIRE 464 752 384 752
WIRE 80 800 80 752
WIRE 144 848 144 768
WIRE 144 848 96 848
WIRE 288 848 288 656
WIRE 288 848 144 848
WIRE 480 848 480 768
WIRE 480 848 288 848
WIRE 768 848 720 848
WIRE 896 848 848 848
WIRE 928 848 896 848
WIRE 1120 848 1072 848
WIRE 1248 848 1200 848
WIRE 1280 848 1248 848
WIRE 48 896 48 864
WIRE 64 896 48 896
WIRE 80 896 80 864
WIRE 80 896 64 896
WIRE 720 912 720 848
WIRE 896 912 896 848
WIRE 1072 912 1072 848
WIRE 1248 912 1248 848
WIRE 64 944 64 896
WIRE 64 944 -144 944
WIRE 416 944 416 720
WIRE 416 944 64 944
WIRE 288 1056 288 848
WIRE 640 1056 640 656
WIRE 640 1056 288 1056
WIRE 720 1056 720 992
WIRE 720 1056 640 1056
WIRE 896 1056 896 976
WIRE 896 1056 720 1056
WIRE 1072 1056 1072 992
WIRE 1072 1056 896 1056
WIRE 1248 1056 1248 976
WIRE 1248 1056 1072 1056
WIRE 720 1088 720 1056
FLAG -144 576 D
IOPIN -144 576 In
FLAG -144 944 CLK
IOPIN -144 944 In
FLAG 560 576 S2
FLAG 560 720 R2
FLAG 928 448 Q
IOPIN 928 448 Out
FLAG 1280 448 Qb
IOPIN 1280 448 Out
FLAG 224 576 S1
FLAG 224 720 R1
FLAG 384 576 Q1
FLAG 384 752 QB1
FLAG 928 848 Q1
FLAG 1280 848 Qb1
FLAG 720 1088 G
IOPIN 720 1088 BiDir
SYMBOL Digital\\and 496 528 R0
WINDOW 0 -33 16 Left 2
SYMATTR InstName A1
SYMATTR SpiceLine Vhigh=5 Vlow=100m Ref=2.5
SYMBOL Digital\\and 496 672 R0
WINDOW 0 -33 16 Left 2
SYMATTR InstName A3
SYMATTR SpiceLine Vhigh=5 Vlow=100m Ref=2.5
SYMBOL Digital\\and 160 528 R0
WINDOW 0 -33 16 Left 2
SYMATTR InstName A6
SYMATTR SpiceLine Vhigh=5 Vlow=100m Ref=2.5
SYMBOL Digital\\and 160 672 R0
WINDOW 0 -33 16 Left 2
SYMATTR InstName A7
SYMATTR SpiceLine Vhigh=5 Vlow=100m Ref=2.5
SYMBOL Digital\\and -80 672 M90
WINDOW 0 -33 16 Left 2
SYMATTR InstName A8
SYMATTR SpiceLine Vhigh=5 Vlow=100m Ref=2.5 Td=20n
SYMBOL Digital\\and 0 832 R270
WINDOW 0 -33 16 Left 2
SYMATTR InstName A9
SYMATTR SpiceLine Vhigh=5 Vlow=100m Ref=2.5
SYMBOL bv 720 496 R0
WINDOW 0 50 50 Left 2
WINDOW 3 65 218 Left 2
SYMATTR InstName BQ1
SYMATTR Value V=If((V(R2,G)<2.5) & ((V(S2,G)>2.5) | (V(Qb,G)<2.5)),5,100m)
SYMBOL res 864 432 R90
WINDOW 0 0 56 VBottom 2
WINDOW 3 32 56 VTop 2
SYMATTR InstName R1
SYMATTR Value 30
SYMBOL cap 880 512 R0
WINDOW 0 45 19 Left 2
WINDOW 3 48 46 Left 2
WINDOW 123 48 74 Left 2
SYMATTR InstName C1
SYMATTR Value 100p
SYMATTR Value2 IC=0
SYMBOL bv 1072 496 R0
WINDOW 0 45 58 Left 2
WINDOW 3 -61 185 Left 2
SYMATTR InstName BQB1
SYMATTR Value V=If((V(R2,G)>2.5) | ((V(Q,G)<2.5) & (V(S2,G)<2.5)),5,100m)
SYMBOL res 1216 432 R90
WINDOW 0 0 56 VBottom 2
WINDOW 3 32 56 VTop 2
SYMATTR InstName R2
SYMATTR Value 30
SYMBOL cap 1232 512 R0
WINDOW 0 45 19 Left 2
WINDOW 3 48 46 Left 2
WINDOW 123 48 74 Left 2
SYMATTR InstName C2
SYMATTR Value 100p
SYMATTR Value2 IC=5
SYMBOL bv 720 896 R0
WINDOW 0 50 50 Left 2
WINDOW 3 67 218 Left 2
SYMATTR InstName BQ2
SYMATTR Value V=If((V(R1,G)<2.5) & ((V(S1,G)>2.5) | (V(Qb,G)<2.5)),5,100m)
SYMBOL res 864 832 R90
WINDOW 0 0 56 VBottom 2
WINDOW 3 32 56 VTop 2
SYMATTR InstName R3
SYMATTR Value 100
SYMBOL cap 880 912 R0
WINDOW 0 45 19 Left 2
WINDOW 3 48 46 Left 2
WINDOW 123 48 74 Left 2
SYMATTR InstName C3
SYMATTR Value 70p
SYMATTR Value2 IC=0
SYMBOL bv 1072 896 R0
WINDOW 0 45 58 Left 2
WINDOW 3 -60 184 Left 2
SYMATTR InstName BQB2
SYMATTR Value V=If((V(R1,G)>2.5) | ((V(Q1,G)<2.5) & (V(S1,G)<2.5)),5,100m)
SYMBOL res 1216 832 R90
WINDOW 0 0 56 VBottom 2
WINDOW 3 32 56 VTop 2
SYMATTR InstName R4
SYMATTR Value 100
SYMBOL cap 1232 912 R0
WINDOW 0 45 19 Left 2
WINDOW 3 48 46 Left 2
WINDOW 123 48 74 Left 2
SYMATTR InstName C4
SYMATTR Value 70p
SYMATTR Value2 IC=5
TEXT -360 752 Left 2 ;20-ns delay in A8 to fix a logic \nglitch when the two flip-flops toggle.

sr_latch_g.asc, the sub-circuit schematic file:
Version 4.1
SHEET 1 1168 680
WIRE -192 48 -256 48
WIRE -32 48 -96 48
WIRE 160 64 112 64
WIRE 288 64 240 64
WIRE 320 64 288 64
WIRE 512 64 464 64
WIRE 640 64 592 64
WIRE 672 64 640 64
WIRE -192 112 -192 48
WIRE -32 112 -32 48
WIRE 112 128 112 64
WIRE 288 128 288 64
WIRE 464 128 464 64
WIRE 640 128 640 64
WIRE -192 272 -192 192
WIRE -32 272 -32 192
WIRE -32 272 -192 272
WIRE 112 272 112 208
WIRE 112 272 -32 272
WIRE 288 272 288 192
WIRE 288 272 112 272
WIRE 464 272 464 208
WIRE 464 272 288 272
WIRE 640 272 640 192
WIRE 640 272 464 272
WIRE -32 304 -32 272
FLAG -256 48 R
IOPIN -256 48 In
FLAG -96 48 S
IOPIN -96 48 In
FLAG 320 64 Q
IOPIN 320 64 Out
FLAG 672 64 Qb
IOPIN 672 64 Out
FLAG 112 64 a
FLAG 464 64 b
FLAG -32 304 G
IOPIN -32 304 In
SYMBOL bv 112 112 R0
WINDOW 0 50 50 Left 2
WINDOW 3 -4 218 Left 2
SYMATTR InstName BQ
SYMATTR Value V=If((V(R,G)<2.5) & ((V(S,G)>2.5) | (V(Qb,G)<2.5)),5,100m)
SYMBOL res -208 96 R0
SYMATTR InstName R1
SYMATTR Value 1Meg
SYMBOL res -48 96 R0
SYMATTR InstName R2
SYMATTR Value 1Meg
SYMBOL res 256 48 R90
WINDOW 0 0 56 VBottom 2
WINDOW 3 32 56 VTop 2
SYMATTR InstName R3
SYMATTR Value 10
SYMBOL cap 272 128 R0
WINDOW 0 45 19 Left 2
WINDOW 3 48 46 Left 2
WINDOW 123 48 74 Left 2
SYMATTR InstName C1
SYMATTR Value 10p
SYMATTR Value2 IC=0
SYMBOL bv 464 112 R0
WINDOW 0 45 58 Left 2
WINDOW 3 -2 183 Left 2
SYMATTR InstName BQB
SYMATTR Value V=If((V(R,G)>2.5) | ((V(Q,G)<2.5) & (V(S,G)<2.5)),5,100m)
SYMBOL res 608 48 R90
WINDOW 0 0 56 VBottom 2
WINDOW 3 32 56 VTop 2
SYMATTR InstName R4
SYMATTR Value 10
SYMBOL cap 624 128 R0
WINDOW 0 45 19 Left 2
WINDOW 3 48 46 Left 2
WINDOW 123 48 74 Left 2
SYMATTR InstName C2
SYMATTR Value 10p
SYMATTR Value2 IC=5

ct_xfmr.asc, the sub-circuit schematic file:
Version 4
SHEET 1 880 680
WIRE 32 96 -48 96
WIRE 64 96 32 96
WIRE 160 96 144 96
WIRE 368 96 304 96
WIRE 496 96 448 96
WIRE 624 96 576 96
WIRE 32 144 32 96
WIRE 160 144 160 96
WIRE 304 144 304 96
WIRE 32 288 32 224
WIRE 32 288 -48 288
WIRE 160 288 160 224
WIRE 160 288 32 288
WIRE 304 288 304 224
WIRE 624 288 304 288
FLAG 624 96 4
IOPIN 624 96 Out
FLAG 624 288 3
IOPIN 624 288 Out
FLAG -48 96 1
IOPIN -48 96 In
FLAG -48 288 2
IOPIN -48 288 In
SYMBOL bi 160 144 R0
WINDOW 0 45 39 Left 2
WINDOW 3 -94 169 Left 2
SYMATTR InstName B1
SYMATTR Value I=I(V1)*{N}
SYMBOL bv 304 128 R0
WINDOW 0 40 42 Left 2
WINDOW 3 40 70 Left 2
SYMATTR InstName B2
SYMATTR Value V=V(1,2)*{N}
SYMBOL voltage 352 96 R270
WINDOW 0 32 56 VTop 2
WINDOW 3 -32 56 VBottom 2
WINDOW 123 0 0 Left 0
WINDOW 39 0 0 Left 0
SYMATTR InstName V1
SYMATTR Value 0
SYMBOL res 592 80 R90
WINDOW 0 0 56 VBottom 2
WINDOW 3 32 56 VTop 2
SYMATTR InstName R1
SYMATTR Value 1m
SYMBOL res 16 128 R0
SYMATTR InstName R2
SYMATTR Value 1Meg
SYMBOL res 160 80 R90
WINDOW 0 0 56 VBottom 2
WINDOW 3 32 56 VTop 2
SYMATTR InstName R3
SYMATTR Value 1m

xfmr.asc, the sub-circuit schematic file:
Version 4.1
SHEET 1 880 680
WIRE 32 96 -48 96
WIRE 160 96 32 96
WIRE 368 96 304 96
WIRE 496 96 448 96
WIRE 624 96 576 96
WIRE 32 144 32 96
WIRE 160 144 160 96
WIRE 304 144 304 96
WIRE 32 288 32 224
WIRE 32 288 -48 288
WIRE 160 288 160 224
WIRE 160 288 32 288
WIRE 304 288 304 224
WIRE 624 288 304 288
FLAG 624 288 4
IOPIN 624 288 Out
FLAG 624 96 3
IOPIN 624 96 Out
FLAG -48 96 1
IOPIN -48 96 In
FLAG -48 288 2
IOPIN -48 288 In
SYMBOL bi 160 144 R0
WINDOW 0 45 39 Left 2
WINDOW 3 -63 163 Left 2
SYMATTR InstName B1
SYMATTR Value I=I(V1)*{ratio}
SYMBOL bv 304 128 R0
WINDOW 0 40 42 Left 2
WINDOW 3 40 70 Left 2
SYMATTR InstName B2
SYMATTR Value V=V(1,2)*{ratio}
SYMBOL voltage 352 96 R270
WINDOW 0 32 56 VTop 2
WINDOW 3 -32 56 VBottom 2
WINDOW 123 0 0 Left 0
WINDOW 39 0 0 Left 0
SYMATTR InstName V1
SYMATTR Value 0
SYMBOL res 592 80 R90
WINDOW 0 0 56 VBottom 2
WINDOW 3 32 56 VTop 2
SYMATTR InstName R1
SYMATTR Value 1µ
SYMBOL res 16 128 R0
SYMATTR InstName R2
SYMATTR Value 1Meg

The netlist it stands for:
* Dual Active Bridge VM - nonisolated - cbc - load step.asc
Lmag p1 N004 720µ
rC Vout N007 10m
C2 N007 0 60µ IC=0
Vin N001 0 700
C1 CS 0 150p
V1 N016 0 {Rlower}
V2 N015 0 {Rupper}
V4 N014 0 {C2}
V5 N013 0 {C1}
V17 N012 0 {fz}
V18 N011 0 {fp}
Rlower FB 0 {Rlower}
Rupper Vout FB {Rupper}
SW3 L2P N002 Q3 0 TOFSW
D3 L2P N002 TOFD
SW4 0 L2P Q4 0 TOFSW
D5 0 L2P TOFD
SW2 0 L1P Q3 0 TOFSW
D6 0 L1P TOFD
SW1 L1P N002 Q4 0 TOFSW
D7 L1P N002 TOFD
V8 L1P p1 0
Lr N006 N004 32µ
C3 N008 FB {C1}
R1 CMP N008 {R2}
C4 CMP FB {C2}
R2 VCT CS 100
L2 0 N003 22m
R4 0 N003 2.2k
D4 N003 VCT 1N4148
R5 0 VCT 2
R6 N006 L2P 1m
SW7 L2S Vout Q7 0 TOFSW
D1 L2S Vout TOFD
SW8 0 L2S Q8 0 TOFSW
D2 0 L2S TOFD
SW6 0 L1S Q7 0 TOFSW
D8 0 L1S TOFD
SW5 L1S Vout Q8 0 TOFSW
D9 L1S Vout TOFD
R7 L2S N005 1m
R8 Vout 0 {RL1}
R9 N009 Vout {RL2}
SW9 0 N009 N010 0 TOFSW
V3 N010 0 PWL(0 0 10m 0 10.001m 5 13m 5 13.001m 0)
X§X1 CS FB 0 CMP Q8 Q7 Q3 Q4 generic_dab_vm_pwm params: gain={gain} pole={pole} Isink={Isink} Isource={Isource} Vlow={VOL} Vhigh={VOH} DT={DT}
X§X4 N001 N002 0 N003 ct_xfmr params: N=200
X§X2 p1 N004 L1S N005 xfmr params: Ratio=650m

* block symbol definitions
.subckt generic_dab_vm_pwm CS FB GNDT CMP DRV1U DRV1L DRV2U DRV2L
X§X1 N010 FB GNDT CMP op_amp_fan_out params: gain={gain} pole={pole} Isink={Isink} Isource={Isource} Vlow={VOL} Vhigh={VOH}
V1 N010 GNDT {Vref}
V3 N012 GNDT PULSE({VV} {VP} 0 {Tsw-2n} 1n 1n {Tsw})
B1 N015 GNDT V=IF(V(CMP,GNDT)*V(SS,GNDT)/3>{0.25*Vp},{0.25*Vp},IF(V(CMP,GNDT)*V(SS,GNDT)/3<10m,10m,V(CMP,GNDT)*V(SS,GNDT)/3))
V4 SS GNDT PWL(0 0 {Tss} 1)
B2 N001 GNDT V=IF(V(G1U,GNDT)>2.5,{VDRV},100m)
B3 N006 GNDT V=IF(V(G1L,GNDT)>2.5,{VDRV},100m)
R1 DRV1L N006 10
C2 DRV1L GNDT 10p
R3 DRV1U N001 10
C3 DRV1U GNDT 10p
A1 GNDT SP1a N003 N004 GNDT GNDT G1U GNDT AND Vhigh=5 Vlow=0 Ref=2.5
A4 SP1a GNDT GNDT GNDT GNDT SP1b N004 GNDT BUF Vhigh=5 Vlow=0 Ref=2.5 Td={DT}
A5 GNDT N007 N003 N008 GNDT GNDT G1L GNDT AND Vhigh=5 Vlow=0 Ref=2.5
A10 N007 GNDT GNDT GNDT GNDT GNDT N008 GNDT BUF Vhigh=5 Vlow=0 Ref=2.5 Td={DT}
A11 GNDT N013 GNDT N013 GNDT N009 clk GNDT AND Vhigh=5 Vlow=0 Ref=2.5
A2 GNDT SP2a N003 N016 GNDT GNDT G2U GNDT AND Vhigh=5 Vlow=0 Ref=2.5
A12 SP2a GNDT GNDT GNDT GNDT SP2b N016 GNDT BUF Vhigh=5 Vlow=0 Ref=2.5 Td={DT}
A13 GNDT N014 N003 N018 GNDT GNDT G2L GNDT AND Vhigh=5 Vlow=0 Ref=2.5
A14 N014 GNDT GNDT GNDT GNDT GNDT N018 GNDT BUF Vhigh=5 Vlow=0 Ref=2.5 Td={DT}
B4 N011 GNDT V=IF(V(G2U,GNDT)>2.5,{VDRV},100m)
B5 N019 GNDT V=IF(V(G2L,GNDT)>2.5,{VDRV},100m)
R4 DRV2L N019 10
C4 DRV2L GNDT 10p
R5 DRV2U N011 10
C5 DRV2U GNDT 10p
V5 N020 GNDT {IMAX}
R6 CS N021 100
C6 N021 GNDT 10p
A3 GNDT SP1a GNDT SP1b GNDT GNDT N002 GNDT AND Vhigh=5 Vlow=0 Ref=2.5
A6 GNDT SP2a GNDT SP2b GNDT GNDT N005 GNDT AND Vhigh=5 Vlow=0 Ref=2.5
A7 GNDT N002 GNDT N005 GNDT GNDT RSTIM GNDT OR Vhigh=5 Vlow=0 Ref=2.5
X§X3 N012 N015 N013 GNDT comptof_g params: VHIGH=5 VLOW=100m VHYS=10m
X§X2 N007 N009 SP1a N007 GNDT d_flipflop_g
X§X4 N014 clk SP2a N014 GNDT d_flipflop_g
X§X5 RSTIM N017 NC_01 N003 GNDT sr_latch_g
X§X7 N020 N021 N017 GNDT comptof_g params: VHIGH=5 VLOW=100m VHYS=50m
* The error voltage is limited
* to clamp on the maximum
* possible angle.
.ends generic_dab_vm_pwm

.subckt op_amp_fan_out + - Masse OUT
G1 Masse N004 + - 100µ
R1 N004 Masse {GAIN/100u}
C1 N004 Masse {1/(6.28*(GAIN/100u)*POLE)}
D1 Masse N004 dopamp
E1 N005 Masse N004 Masse 1
D3 N005 N006 dopamp
I1 N006 Masse {ISINK/185}
Q1 Masse N006 N003 0 2N3906
V1 OUT N003 {VLOW-700m}
I2 N002 OUT {Isource}
D4 OUT N002 dopamp
V3 N001 Masse {VHIGH}
D2 N004 N002 dopamp
R2 N002 N001 10
*
.model dopamp D RS=1m VFWD=1m TT=10n Cjo=10p
*
.ends op_amp_fan_out

.subckt comptof_g INV NINV OUT G
B1 HYS NINV V=IF(V(out) > ({VHIGH}+{VLOW})/2,{VHYS},0)
B2 N001 G V=IF(V(HYS,INV)>0,{VHIGH},{VLOW})
R1 N001 OUT 10
C1 OUT G 10p
R2 INV G 1Meg
.ends comptof_g

.subckt d_flipflop_g D CLK Q Qb G
A1 G Q1 G CLK G G S2 G AND Vhigh=5 Vlow=100m Ref=2.5
A3 G CLK G QB1 G G R2 G AND Vhigh=5 Vlow=100m Ref=2.5
A6 G D G N003 G G S1 G AND Vhigh=5 Vlow=100m Ref=2.5
A7 G N004 G N003 G G R1 G AND Vhigh=5 Vlow=100m Ref=2.5
A8 G D G D G N004 G G AND Vhigh=5 Vlow=100m Ref=2.5 Td=20n
A9 G CLK G CLK G N003 G G AND Vhigh=5 Vlow=100m Ref=2.5
BQ1 N001 G V=If((V(R2,G)<2.5) & ((V(S2,G)>2.5) | (V(Qb,G)<2.5)),5,100m)
R1 Q N001 30
C1 Q G 100p IC=0
BQB1 N002 G V=If((V(R2,G)>2.5) | ((V(Q,G)<2.5) & (V(S2,G)<2.5)),5,100m)
R2 Qb N002 30
C2 Qb G 100p IC=5
BQ2 N005 G V=If((V(R1,G)<2.5) & ((V(S1,G)>2.5) | (V(Qb,G)<2.5)),5,100m)
R3 Q1 N005 100
C3 Q1 G 70p IC=0
BQB2 N006 G V=If((V(R1,G)>2.5) | ((V(Q1,G)<2.5) & (V(S1,G)<2.5)),5,100m)
R4 QB1 N006 100
C4 QB1 G 70p IC=5
* 20-ns delay in A8 to fix a logic
* glitch when the two flip-flops toggle.
.ends d_flipflop_g

.subckt sr_latch_g R S Q Qb G
BQ a G V=If((V(R,G)<2.5) & ((V(S,G)>2.5) | (V(Qb,G)<2.5)),5,100m)
R1 R G 1Meg
R2 S G 1Meg
R3 Q a 10
C1 Q G 10p IC=0
BQB b G V=If((V(R,G)>2.5) | ((V(Q,G)<2.5) & (V(S,G)<2.5)),5,100m)
R4 Qb b 10
C2 Qb G 10p IC=5
.ends sr_latch_g

.subckt ct_xfmr 1 2 3 4
B1 N001 2 I=I(V1)*{N}
B2 N002 3 V=V(1,2)*{N}
V1 N002 N003 0
R1 4 N003 1m
R2 1 2 1Meg
R3 N001 1 1m
.ends ct_xfmr

.subckt xfmr 1 2 3 4
B1 1 2 I=I(V1)*{ratio}
B2 N001 4 V=V(1,2)*{ratio}
V1 N001 N002 0
R1 3 N002 1µ
R2 1 2 1Meg
.ends xfmr

.model D D
.lib standard.dio
.model NPN NPN
.model PNP PNP
.lib standard.bjt
.tran 0 15m 9.5m uic
*
.param Fsw=200k
.param Tsw={1/Fsw}
.param VDRV=12 ; DRV output
*
*
.param AOL=90
.param GAIN={10**(AOL/20)}
.param pole=30
.param Isink=20m
.param Isource=500u
.param VOL=100m
.param VOH=5
*
.param Vv=0
.param Vp=2 ; sawtooth amplitude
.param Vref=2.5 ; internal voltage reference
.param Tss=1m ; internal soft-start duration
.param DT=50n ; dead time between switches
.param Imax=1 ; maximum sense voltage
*
* The dc labels are the values of the components:
* pV --> pF
* nV --> nF
* kV --> kOhms
* *
* Slopes are in V/s
* Se is determined for a Q of 1
* If Smag>Se, no need for slope comp
* If Smag<Se, add missing slope to match Se
*
.param Vout=500
*
.param Gfc=38 ; magnitude at crossover
.param PS=-83 ; phase lag at crossover
*
* Enter Design Goals Information Here *
*
.param fc=1k ; targeted crossover
.param PM=60 ; choose phase margin at crossover
*
* Enter the Values for Vout and Bridge Bias Current *
*
.param Ibias=1m
.param Rlower={Vref/Ibias}
.param Rupper={(Vout-Vref)/Ibias}
*
* Do not edit the below lines *
*
.param boost={PM-PS-90}
.param G={10**(-Gfc/20)}
.param fp={(tan(boost*pi/180)+sqrt((tan(boost*pi/180))**2+1))*fc}
.param fz={fc**2/fp}
.param a={sqrt((fc**2/fp**2)+1)}
.param b={sqrt((fz**2/fc**2)+1)}
.param R2={((a/b)*G*Rupper*fp)/(fp-fz)}
.param C1={1/(2*pi*R2*fz)}
.param C2={C1/(C1*R2*2*pi*fp-1)}
*
.options abstol=1u vntol=1m reltol=0.01 gmin=1n
+method=gear
*
.MODEL TOFSW SW(Ron=20m Roff=10Meg Vt=2 Vh=1)
.model TOFD D(IS=23.367E-18 N=.9983 RS=77.399E-3 IKF=1.0000E3 CJO=453.20E-12 M=.44242
+ VJ=1.3170 ISR=31.573E-9 NR=2.4162 TT=0 XTI=2 EG=3.26 FC=0.5)
; STPSC10H12CWL
*
*
.param P=10k
.param step=30 ; if step=30, then load is first 70% then goes 100%
.param RL1={Vout**2/(P*(1-step/100))} ; first load
.param RL2={Vout**2/(P*(step/100))} ; final load
.param Rload={Vout**2/P} ; nominal 100% load
*
.backanno
.end